# Altium project PCB_Project_1.PrjPcb
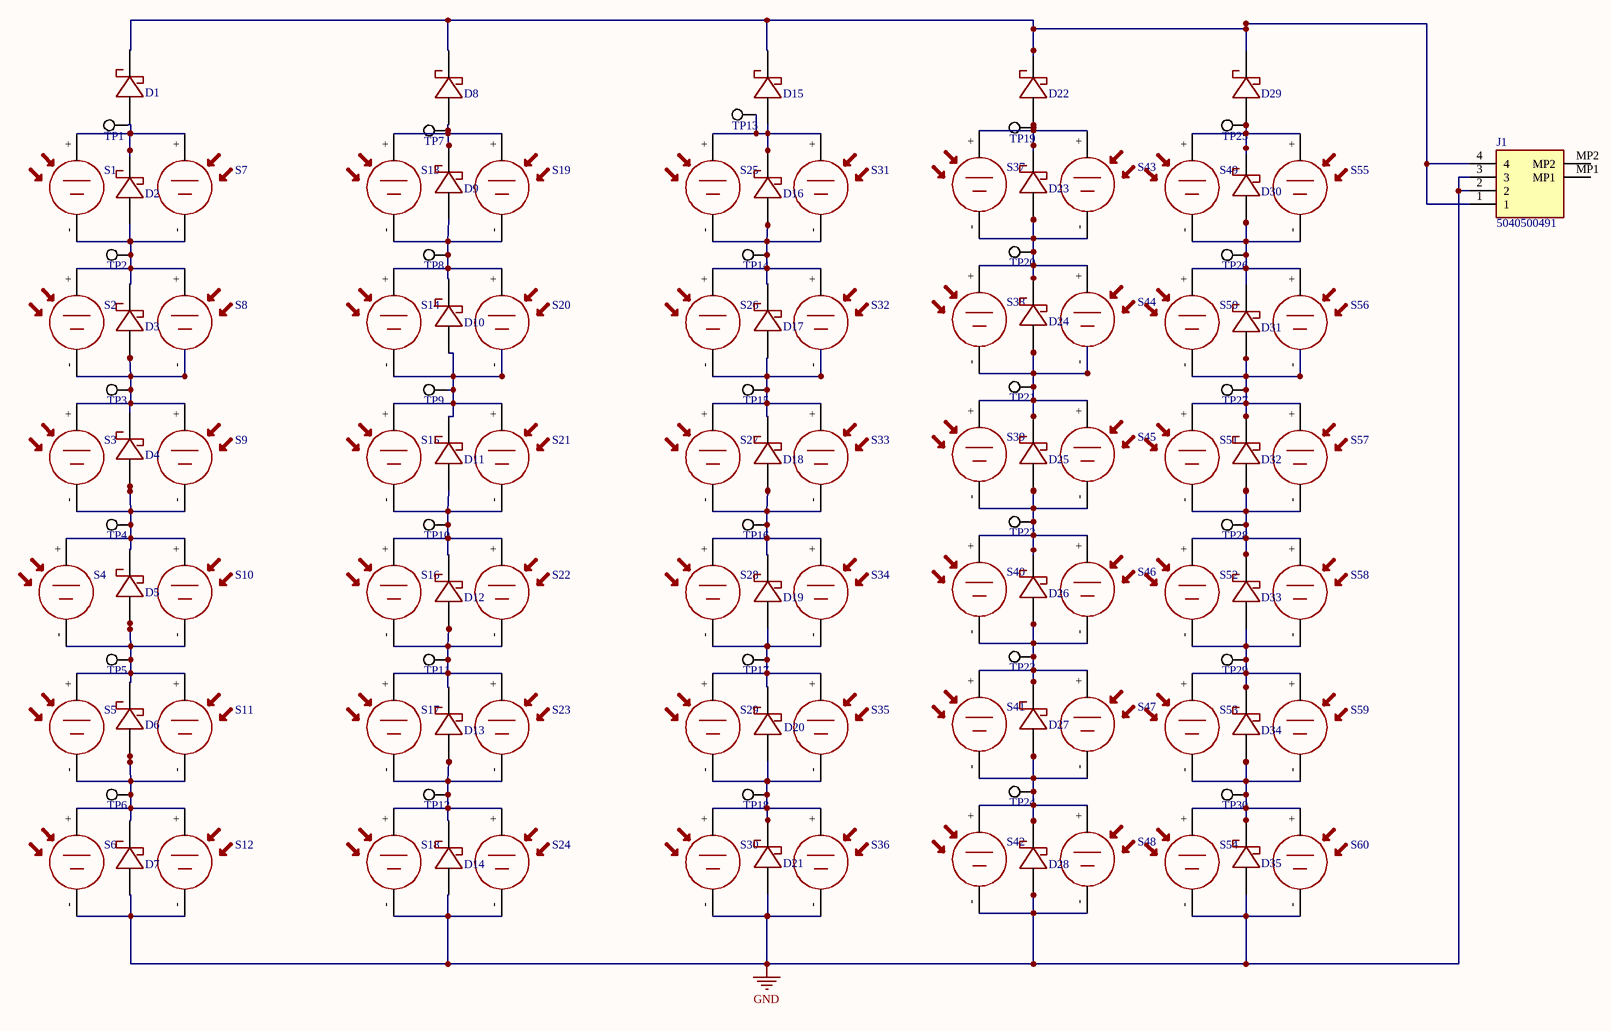
[diagram p0: SolarPanel4.SchDoc]
1 sheet, 126 parts. Net scope: global (net labels, ports and power ports of the same name join across sheets).
Board file: SolarPanel.PcbDoc

## Sheet SolarPanel4.SchDoc
size C

### Parts
D1  SCHOTTKY_DIODE_B120-FDICT-NDSCHOTTKY_DIODE_B120-FDICT-ND  [SB_DIODE]  (value not drawn)
D2  SCHOTTKY_DIODE_B120-FDICT-NDSCHOTTKY_DIODE_B120-FDICT-ND  [SB_DIODE]  (value not drawn)
D3  SCHOTTKY_DIODE_B120-FDICT-NDSCHOTTKY_DIODE_B120-FDICT-ND  [SB_DIODE]  (value not drawn)
D4  SCHOTTKY_DIODE_B120-FDICT-NDSCHOTTKY_DIODE_B120-FDICT-ND  [SB_DIODE]  (value not drawn)
D5  SCHOTTKY_DIODE_B120-FDICT-NDSCHOTTKY_DIODE_B120-FDICT-ND  [SB_DIODE]  (value not drawn)
D6  SCHOTTKY_DIODE_B120-FDICT-NDSCHOTTKY_DIODE_B120-FDICT-ND  [SB_DIODE]  (value not drawn)
D7  SCHOTTKY_DIODE_B120-FDICT-NDSCHOTTKY_DIODE_B120-FDICT-ND  [SB_DIODE]  (value not drawn)
D8  SCHOTTKY_DIODE_B120-FDICT-NDSCHOTTKY_DIODE_B120-FDICT-ND  [SB_DIODE]  (value not drawn)
D9  SCHOTTKY_DIODE_B120-FDICT-NDSCHOTTKY_DIODE_B120-FDICT-ND  [SB_DIODE]  (value not drawn)
D10  SCHOTTKY_DIODE_B120-FDICT-NDSCHOTTKY_DIODE_B120-FDICT-ND  [SB_DIODE]  (value not drawn)
D11  SCHOTTKY_DIODE_B120-FDICT-NDSCHOTTKY_DIODE_B120-FDICT-ND  [SB_DIODE]  (value not drawn)
D12  SCHOTTKY_DIODE_B120-FDICT-NDSCHOTTKY_DIODE_B120-FDICT-ND  [SB_DIODE]  (value not drawn)
D13  SCHOTTKY_DIODE_B120-FDICT-NDSCHOTTKY_DIODE_B120-FDICT-ND  [SB_DIODE]  (value not drawn)
D14  SCHOTTKY_DIODE_B120-FDICT-NDSCHOTTKY_DIODE_B120-FDICT-ND  [SB_DIODE]  (value not drawn)
D15  SCHOTTKY_DIODE_B120-FDICT-NDSCHOTTKY_DIODE_B120-FDICT-ND  [SB_DIODE]  (value not drawn)
D16  SCHOTTKY_DIODE_B120-FDICT-NDSCHOTTKY_DIODE_B120-FDICT-ND  [SB_DIODE]  (value not drawn)
D17  SCHOTTKY_DIODE_B120-FDICT-NDSCHOTTKY_DIODE_B120-FDICT-ND  [SB_DIODE]  (value not drawn)
D18  SCHOTTKY_DIODE_B120-FDICT-NDSCHOTTKY_DIODE_B120-FDICT-ND  [SB_DIODE]  (value not drawn)
D19  SCHOTTKY_DIODE_B120-FDICT-NDSCHOTTKY_DIODE_B120-FDICT-ND  [SB_DIODE]  (value not drawn)
D20  SCHOTTKY_DIODE_B120-FDICT-NDSCHOTTKY_DIODE_B120-FDICT-ND  [SB_DIODE]  (value not drawn)
D21  SCHOTTKY_DIODE_B120-FDICT-NDSCHOTTKY_DIODE_B120-FDICT-ND  [SB_DIODE]  (value not drawn)
D22  SCHOTTKY_DIODE_B120-FDICT-NDSCHOTTKY_DIODE_B120-FDICT-ND  [SB_DIODE]  (value not drawn)
D23  SCHOTTKY_DIODE_B120-FDICT-NDSCHOTTKY_DIODE_B120-FDICT-ND  [SB_DIODE]  (value not drawn)
D24  SCHOTTKY_DIODE_B120-FDICT-NDSCHOTTKY_DIODE_B120-FDICT-ND  [SB_DIODE]  (value not drawn)
D25  SCHOTTKY_DIODE_B120-FDICT-NDSCHOTTKY_DIODE_B120-FDICT-ND  [SB_DIODE]  (value not drawn)
D26  SCHOTTKY_DIODE_B120-FDICT-NDSCHOTTKY_DIODE_B120-FDICT-ND  [SB_DIODE]  (value not drawn)
D27  SCHOTTKY_DIODE_B120-FDICT-NDSCHOTTKY_DIODE_B120-FDICT-ND  [SB_DIODE]  (value not drawn)
D28  SCHOTTKY_DIODE_B120-FDICT-NDSCHOTTKY_DIODE_B120-FDICT-ND  [SB_DIODE]  (value not drawn)
D29  SCHOTTKY_DIODE_B120-FDICT-NDSCHOTTKY_DIODE_B120-FDICT-ND  [SB_DIODE]  (value not drawn)
D30  SCHOTTKY_DIODE_B120-FDICT-NDSCHOTTKY_DIODE_B120-FDICT-ND  [SB_DIODE]  (value not drawn)
D31  SCHOTTKY_DIODE_B120-FDICT-NDSCHOTTKY_DIODE_B120-FDICT-ND  [SB_DIODE]  (value not drawn)
D32  SCHOTTKY_DIODE_B120-FDICT-NDSCHOTTKY_DIODE_B120-FDICT-ND  [SB_DIODE]  (value not drawn)
D33  SCHOTTKY_DIODE_B120-FDICT-NDSCHOTTKY_DIODE_B120-FDICT-ND  [SB_DIODE]  (value not drawn)
D34  SCHOTTKY_DIODE_B120-FDICT-NDSCHOTTKY_DIODE_B120-FDICT-ND  [SB_DIODE]  (value not drawn)
D35  SCHOTTKY_DIODE_B120-FDICT-NDSCHOTTKY_DIODE_B120-FDICT-ND  [SB_DIODE]  (value not drawn)
J1  5040500491  [5040500491]
S1  SOLAR_CELL  [SOLAR_CELL]  (value not drawn)
S2  SOLAR_CELL  [SOLAR_CELL]  (value not drawn)
S3  SOLAR_CELL  [SOLAR_CELL]  (value not drawn)
S4  SOLAR_CELL  [SOLAR_CELL]  (value not drawn)
S5  SOLAR_CELL  [SOLAR_CELL]  (value not drawn)
S6  SOLAR_CELL  [SOLAR_CELL]  (value not drawn)
S7  SOLAR_CELL  [SOLAR_CELL]  (value not drawn)
S8  SOLAR_CELL  [SOLAR_CELL]  (value not drawn)
S9  SOLAR_CELL  [SOLAR_CELL]  (value not drawn)
S10  SOLAR_CELL  [SOLAR_CELL]  (value not drawn)
S11  SOLAR_CELL  [SOLAR_CELL]  (value not drawn)
S12  SOLAR_CELL  [SOLAR_CELL]  (value not drawn)
S13  SOLAR_CELL  [SOLAR_CELL]  (value not drawn)
S14  SOLAR_CELL  [SOLAR_CELL]  (value not drawn)
S15  SOLAR_CELL  [SOLAR_CELL]  (value not drawn)
S16  SOLAR_CELL  [SOLAR_CELL]  (value not drawn)
S17  SOLAR_CELL  [SOLAR_CELL]  (value not drawn)
S18  SOLAR_CELL  [SOLAR_CELL]  (value not drawn)
S19  SOLAR_CELL  [SOLAR_CELL]  (value not drawn)
S20  SOLAR_CELL  [SOLAR_CELL]  (value not drawn)
S21  SOLAR_CELL  [SOLAR_CELL]  (value not drawn)
S22  SOLAR_CELL  [SOLAR_CELL]  (value not drawn)
S23  SOLAR_CELL  [SOLAR_CELL]  (value not drawn)
S24  SOLAR_CELL  [SOLAR_CELL]  (value not drawn)
S25  SOLAR_CELL  [SOLAR_CELL]  (value not drawn)
S26  SOLAR_CELL  [SOLAR_CELL]  (value not drawn)
S27  SOLAR_CELL  [SOLAR_CELL]  (value not drawn)
S28  SOLAR_CELL  [SOLAR_CELL]  (value not drawn)
S29  SOLAR_CELL  [SOLAR_CELL]  (value not drawn)
S30  SOLAR_CELL  [SOLAR_CELL]  (value not drawn)
S31  SOLAR_CELL  [SOLAR_CELL]  (value not drawn)
S32  SOLAR_CELL  [SOLAR_CELL]  (value not drawn)
S33  SOLAR_CELL  [SOLAR_CELL]  (value not drawn)
S34  SOLAR_CELL  [SOLAR_CELL]  (value not drawn)
S35  SOLAR_CELL  [SOLAR_CELL]  (value not drawn)
S36  SOLAR_CELL  [SOLAR_CELL]  (value not drawn)
S37  SOLAR_CELL  [SOLAR_CELL]  (value not drawn)
S38  SOLAR_CELL  [SOLAR_CELL]  (value not drawn)
S39  SOLAR_CELL  [SOLAR_CELL]  (value not drawn)
S40  SOLAR_CELL  [SOLAR_CELL]  (value not drawn)
S41  SOLAR_CELL  [SOLAR_CELL]  (value not drawn)
S42  SOLAR_CELL  [SOLAR_CELL]  (value not drawn)
S43  SOLAR_CELL  [SOLAR_CELL]  (value not drawn)
S44  SOLAR_CELL  [SOLAR_CELL]  (value not drawn)
S45  SOLAR_CELL  [SOLAR_CELL]  (value not drawn)
S46  SOLAR_CELL  [SOLAR_CELL]  (value not drawn)
S47  SOLAR_CELL  [SOLAR_CELL]  (value not drawn)
S48  SOLAR_CELL  [SOLAR_CELL]  (value not drawn)
S49  SOLAR_CELL  [SOLAR_CELL]  (value not drawn)
S50  SOLAR_CELL  [SOLAR_CELL]  (value not drawn)
S51  SOLAR_CELL  [SOLAR_CELL]  (value not drawn)
S52  SOLAR_CELL  [SOLAR_CELL]  (value not drawn)
S53  SOLAR_CELL  [SOLAR_CELL]  (value not drawn)
S54  SOLAR_CELL  [SOLAR_CELL]  (value not drawn)
S55  SOLAR_CELL  [SOLAR_CELL]  (value not drawn)
S56  SOLAR_CELL  [SOLAR_CELL]  (value not drawn)
S57  SOLAR_CELL  [SOLAR_CELL]  (value not drawn)
S58  SOLAR_CELL  [SOLAR_CELL]  (value not drawn)
S59  SOLAR_CELL  [SOLAR_CELL]  (value not drawn)
S60  SOLAR_CELL  [SOLAR_CELL]  (value not drawn)
TP1  TEST_POINT  [TEST_POINT]  (value not drawn)
TP2  TEST_POINT  [TEST_POINT]  (value not drawn)
TP3  TEST_POINT  [TEST_POINT]  (value not drawn)
TP4  TEST_POINT  [TEST_POINT]  (value not drawn)
TP5  TEST_POINT  [TEST_POINT]  (value not drawn)
TP6  TEST_POINT  [TEST_POINT]  (value not drawn)
TP7  TEST_POINT  [TEST_POINT]  (value not drawn)
TP8  TEST_POINT  [TEST_POINT]  (value not drawn)
TP9  TEST_POINT  [TEST_POINT]  (value not drawn)
TP10  TEST_POINT  [TEST_POINT]  (value not drawn)
TP11  TEST_POINT  [TEST_POINT]  (value not drawn)
TP12  TEST_POINT  [TEST_POINT]  (value not drawn)
TP13  TEST_POINT  [TEST_POINT]  (value not drawn)
TP14  TEST_POINT  [TEST_POINT]  (value not drawn)
TP15  TEST_POINT  [TEST_POINT]  (value not drawn)
TP16  TEST_POINT  [TEST_POINT]  (value not drawn)
TP17  TEST_POINT  [TEST_POINT]  (value not drawn)
TP18  TEST_POINT  [TEST_POINT]  (value not drawn)
TP19  TEST_POINT  [TEST_POINT]  (value not drawn)
TP20  TEST_POINT  [TEST_POINT]  (value not drawn)
TP21  TEST_POINT  [TEST_POINT]  (value not drawn)
TP22  TEST_POINT  [TEST_POINT]  (value not drawn)
TP23  TEST_POINT  [TEST_POINT]  (value not drawn)
TP24  TEST_POINT  [TEST_POINT]  (value not drawn)
TP25  TEST_POINT  [TEST_POINT]  (value not drawn)
TP26  TEST_POINT  [TEST_POINT]  (value not drawn)
TP27  TEST_POINT  [TEST_POINT]  (value not drawn)
TP28  TEST_POINT  [TEST_POINT]  (value not drawn)
TP29  TEST_POINT  [TEST_POINT]  (value not drawn)
TP30  TEST_POINT  [TEST_POINT]  (value not drawn)

### Nets
GND: D7.NEG D14.NEG D21.NEG D28.NEG J1.2 J1.3 S6.- S12.- S18.- S24.- S30.- S36.- S42.- S48.- S54.- S60.-
NetD1_POS: D1.POS D8.POS D15.POS D22.POS D29.POS J1.1 J1.4
NetD2_NEG: D2.NEG D3.POS S1.- S2.+ S7.- S8.+ TP2.38
NetD2_POS: D2.POS S1.+ S7.+ TP1.38
NetD3_NEG: D3.NEG D4.POS S2.- S3.+ S8.- S9.+ TP3.38
NetD4_NEG: D4.NEG D5.POS S3.- S4.+ S9.- S10.+ TP4.38
NetD5_NEG: D5.NEG D6.POS S4.- S5.+ S10.- S11.+ TP5.38
NetD6_NEG: D6.NEG D7.POS S5.- S6.+ S11.- S12.+ TP6.38
NetD8_NEG: D8.NEG D9.POS S13.+ S19.+ TP7.38
NetD9_NEG: D9.NEG D10.POS S13.- S14.+ S19.- S20.+ TP8.38
NetD10_NEG: D10.NEG D11.POS S14.- S15.+ S20.- S21.+ TP9.38
NetD11_NEG: D11.NEG D12.POS S15.- S16.+ S21.- S22.+ TP10.38
NetD12_NEG: D12.NEG D13.POS S16.- S17.+ S22.- S23.+ TP11.38
NetD13_NEG: D13.NEG D14.POS S17.- S18.+ S23.- S24.+ TP12.38
NetD15_NEG: D15.NEG D16.POS S25.+ S31.+ TP13.38
NetD16_NEG: D16.NEG D17.POS S25.- S26.+ S31.- S32.+ TP14.38
NetD17_NEG: D17.NEG D18.POS S26.- S27.+ S32.- S33.+ TP15.38
NetD18_NEG: D18.NEG D19.POS S27.- S28.+ S33.- S34.+ TP16.38
NetD19_NEG: D19.NEG D20.POS S28.- S29.+ S34.- S35.+ TP17.38
NetD20_NEG: D20.NEG D21.POS S29.- S30.+ S35.- S36.+ TP18.38
NetD22_NEG: D22.NEG D23.POS S37.+ S43.+ TP19.38
NetD23_NEG: D23.NEG D24.POS S37.- S38.+ S43.- S44.+ TP20.38
NetD24_NEG: D24.NEG D25.POS S38.- S39.+ S44.- S45.+ TP21.38
NetD25_NEG: D25.NEG D26.POS S39.- S40.+ S45.- S46.+ TP22.38
NetD26_NEG: D26.NEG D27.POS S40.- S41.+ S46.- S47.+ TP23.38
NetD27_NEG: D27.NEG D28.POS S41.- S42.+ S47.- S48.+ TP24.38
NetD29_NEG: D29.NEG D30.POS S49.+ S55.+ TP25.38
NetD30_NEG: D30.NEG D31.POS S49.- S50.+ S55.- S56.+ TP26.38
NetD31_NEG: D31.NEG D32.POS S50.- S51.+ S56.- S57.+ TP27.38
NetD32_NEG: D32.NEG D33.POS S51.- S52.+ S57.- S58.+ TP28.38
NetD33_NEG: D33.NEG D34.POS S52.- S53.+ S58.- S59.+ TP29.38
NetD34_NEG: D34.NEG D35.POS S53.- S54.+ S59.- S60.+ TP30.38

Not connected (* = marked no-connect by the designer): D1 NEG; D35 NEG; J1 MP1 MP2

### Library data of the parts
D1-D35 = SCHOTTKY_DIODE_B120-FDICT-NDSCHOTTKY_DIODE_B120-FDICT-ND: GateName_1: G$1; SymbolName_1: SCHOTTKY_DIODE_B120-FDICT-ND; DeviceName: SCHOTTKY_DIODE_B120-FDICT-ND; LibraryName: Solar_Fadi; DeviceSetName: SCHOTTKY_DIODE_B120-FDICT-ND; Package: SCHOTTKY_DIODE_B120-FDICT-ND
J1 = 5040500491: Connector; Manufacturer_Name: Molex; Allied_Number: 70331790; Datasheet Link: https://www.molex.com/pdm_docs/sd/5040500691_sd.pdf; Height: 2.15mm; Manufacturer_Part_Number: 5040500491; Allied Price/Stock: https://www.alliedelec.com/molex-incorporated-5040500491/70331790/
TP1-TP30 = TEST_POINT: pin to pad: 38>PAD